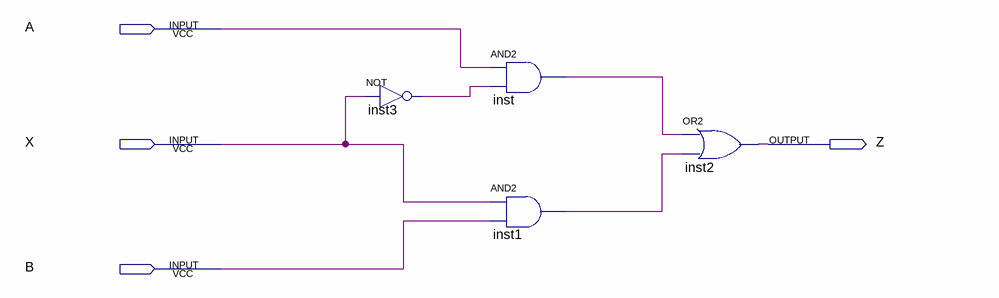
[diagram p0: schematic sheet]
// Quartus schematic 2mux.bdf as structural Verilog: 4 symbols, 4 pins
module \2mux  (
  input  A,
  input  X,
  input  B,
  output Z
);

  wire inst1_out, inst3_out, inst_out;

  not inst3 (inst3_out, X);
  and inst (inst_out, A, inst3_out);
  and inst1 (inst1_out, X, B);
  or inst2 (Z, inst_out, inst1_out);
endmodule
